# Altium schematic sheet Nrf2460_1.SchDoc: nRF2789_Dual_Wireless_Mic_RX
size A4; DrawnBy: ANOL; Revision: 1.0
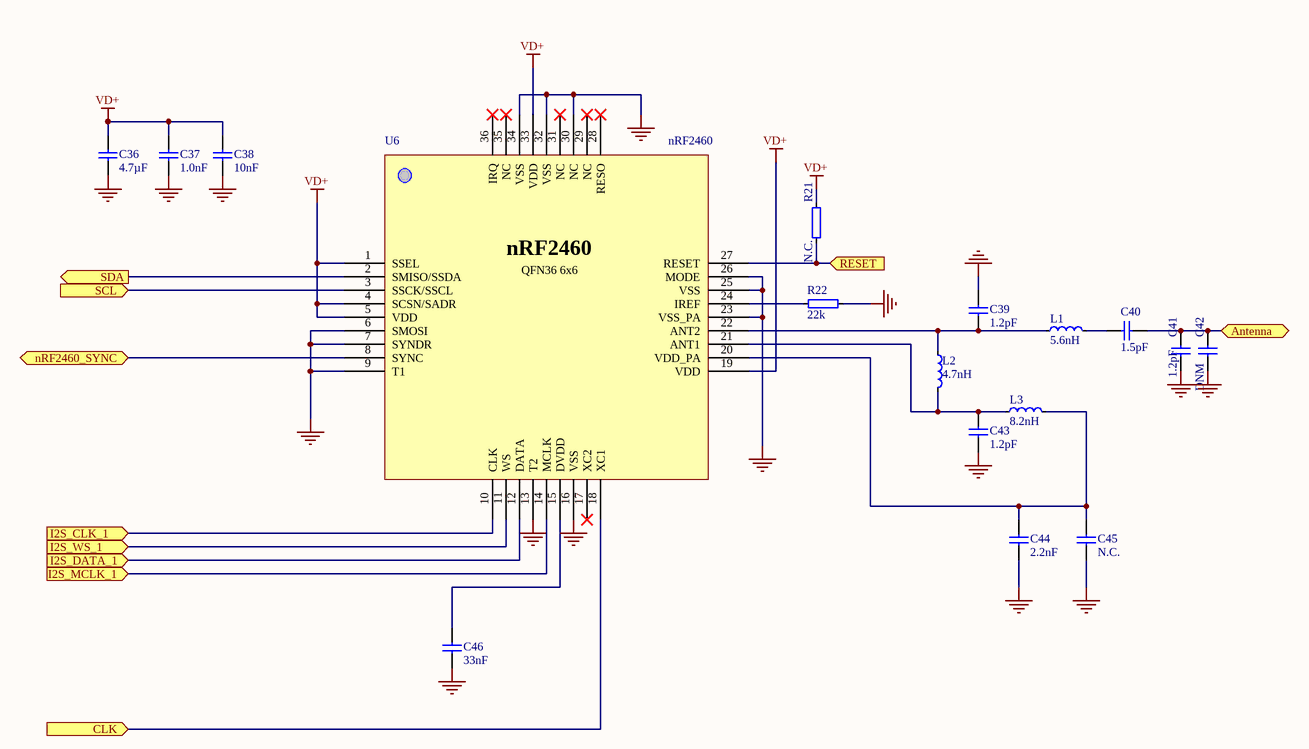
[diagram p0: Nrf2460_1.SchDoc]

## Parts
C36  4.7µF  [0805]
C37  1.0nF  [0402s]
C38  10nF  [0402s]
C39  1.2pF  [0402s]
C40  1.5pF  [0402s]
C41  1.2pF  [0402s]
C42  DNM  [0402s]
C43  1.2pF  [0402s]
C44  2.2nF  [0402s]
C45  N.C.  [0402s]  (no BOM)
C46  33nF  [0402s]
L1  5.6nH  [0402s]
L2  4.7nH  [0402s]
L3  8.2nH  [0402s]
R21  N.C.  [0402s]  (no BOM)
R22  22k  [0402s]
U6  nRF2460  [Nordic_QFN36]

## Ports
Antenna (bidir), CLK (in), I2S_CLK_1 (in), I2S_DATA_1 (in), I2S_MCLK_1 (in), I2S_WS_1 (in), nRF2460_SYNC (bidir), RESET (in), SCL (in), SDA (out)

## Nets
GND: C36.2 C37.2 C38.2 C39.2 C41.1 C42.1 C43.1 C44.1 C45.1 C46.1 R22.1 U6.6(SMOSI) U6.7(SYNDR) U6.9(T1) U6.13(T2) U6.16(VSS) U6.23(VSS_PA) U6.25(VSS) U6.26(MODE) U6.30(NC) U6.32(VSS) U6.34(VSS)
VD+: C36.1 C37.1 C38.1 R21.2 U6.1(SSEL) U6.4(SCSN/SADR) U6.5(VDD) U6.19(VDD) U6.33(VDD)
Antenna: C40.1 C41.2 C42.2 ; port Antenna
CLK: U6.18(XC1) ; port CLK
I2S_CLK_1: U6.10(CLK) ; port I2S_CLK_1
I2S_DATA_1: U6.12(DATA) ; port I2S_DATA_1
I2S_MCLK_1: U6.14(MCLK) ; port I2S_MCLK_1
I2S_WS_1: U6.11(WS) ; port I2S_WS_1
nRF2460_SYNC: U6.8(SYNC) ; port nRF2460_SYNC
RESET: R21.1 U6.27(RESET) ; port RESET
SCL: U6.3(SSCK/SSCL) ; port SCL
SDA: U6.2(SMISO/SSDA) ; port SDA
NetC39_1: C39.1 L1.1 L2.1 U6.22(ANT2)
NetC40_2: C40.2 L1.2
NetC43_2: C43.2 L2.2 L3.1 U6.21(ANT1)
NetC44_2: C44.2 C45.2 L3.2 U6.20(VDD_PA)
NetC46_2: C46.2 U6.15(DVDD)
NetR22_2: R22.2 U6.24(IREF)

Not connected (* = marked no-connect by the designer): U6 17(XC2)* 28(RESO)* 29(NC)* 31(NC)* 35(NC)* 36(IRQ)*

## Notes on the sheet
- (in symbol nRF2460) QFN36 6x6

## Library data of the parts
C36 = C0805-4µ7: Chip Cap 0805; Note: Chip Cap 10%; Artikkelnr Noca: 20039266; Published: 2009-08-21; LatestRevisionDate: 2009-11-23; Publisher: Nordic Semiconductor; Value: 4.7µF; Part Number: C0805-4µ7; Manufacturer: *; Manufacturer Part Number: *; Datasheet: *; Pin Count: 2; Supplier: *; Supplier part number: *; 2nd source Supplier: *; 2nd source part number: *
C37 = C0402-1n0: Chip Cap 0402; Note: Chip Cap 10%; Artikkelnr Noca: 20039223; Published: 2009-05-08; LatestRevisionDate: 2009-11-23; Publisher: Nordic Semiconductor; Value: 1.0nF; Part Number: C0402-1n0; Manufacturer: *; Manufacturer Part Number: *; Datasheet: *; Pin Count: 2; Supplier: *; Supplier part number: *; 2nd source Supplier: *; 2nd source part number: *
C38 = C0402-10n: Chip Cap 0402; Note: Chip Cap 10%; Artikkelnr Noca: 20039166; Published: 2009-05-08; LatestRevisionDate: 2009-11-23; Publisher: Nordic Semiconductor; Value: 10nF; Part Number: C0402-10n; Manufacturer: *; Manufacturer Part Number: *; Datasheet: *; Pin Count: 2; Supplier: *; Supplier part number: *; 2nd source Supplier: *; 2nd source part number: *
C39 C41-C43 = C0402-1.2p: Chip Cap 0402; Note: Chip Cap 1%; Artikkelnr Noca: N.A.; Part Number: C0402-1.2p; Manufacturer: *; Manufacturer Part Number: *; Datasheet: *; LatestRevisionDate: 2009-05-08; Pin Count: 2; Publisher: Nordic Semiconductor; Published: 2009-05-08; Supplier: *; Supplier part number: *; 2nd source Supplier: *; 2nd source part number: *
  C39 C41 C43: Value: 1.2pF
  C42: Value: DNM
C40 = C0402-1.5p: Chip Cap 0402; Note: Chip Cap 1%; Artikkelnr Noca: 20029139; Part Number: C0402-1.5p; Manufacturer: *; Manufacturer Part Number: *; Datasheet: *; LatestRevisionDate: 2009-11-23; Pin Count: 2; Publisher: Nordic Semiconductor; Published: 2009-05-08; Value: 1.5pF; Supplier: *; Supplier part number: *; 2nd source Supplier: *; 2nd source part number: *
C44 = C0402-2n2: Chip Cap 0402; Note: Chip Cap 10%; Artikkelnr Noca: 20039221; Part Number: C0402-2n2; Manufacturer: *; Manufacturer Part Number: *; Datasheet: *; LatestRevisionDate: 2009-11-23; Pin Count: 2; Publisher: Nordic Semiconductor; Published: 2009-05-08; Value: 2.2nF; Supplier: *; Supplier part number: *; 2nd source Supplier: *; 2nd source part number: *
C45 = C0402-N.C.: Chip Cap 0402; Artikkelnr Noca: N.A.; Part Number: C0402-N.C.; Manufacturer: *; Manufacturer Part Number: *; Datasheet: *; LatestRevisionDate: 2009-05-08; Pin Count: 2; Publisher: Nordic Semiconductor; Published: 2009-05-08; Value: N.C.; Note: Chip Cap; Supplier: *; Supplier part number: *; 2nd source Supplier: *; 2nd source part number: *
C46 = C0402-33n: Chip Cap 0402; Note: Chip Cap 10%; Artikkelnr Noca: 20039222; Published: 2009-05-08; Publisher: Nordic Semiconductor; Value: 33nF; Part Number: C0402-33n; Manufacturer: *; Manufacturer Part Number: *; Datasheet: *; LatestRevisionDate: 2009-11-23; Pin Count: 2; Supplier: *; Supplier part number: *; 2nd source Supplier: *; 2nd source part number: *
L1 = L0402-5n6: Chip Ind 0402; Manufacturer: Murata; Manufacturer Part Number: LQP15MN5N6B02D; Note: LQP15MN5N6B02D 5.6nH 140mA 0402; Artikkelnr Noca: 33029161; Part Number: L0402-5n6; Datasheet: http://search.murata.co.jp/Ceramy/image/img/PDF/ENG/L0075S0084LQP15M.pdf; Footprint: 0402; LatestRevisionDate: 2009-11-23; Pin Count: 2; Publisher: Nordic Semiconductor; Published: 2009-05-08; Value: 5.6nH; Supplier: Digi-Key; Supplier part number: 490-1133-1-ND; 2nd source Supplier: *; 2nd source part number: *
L2 = L0402-4n7: Chip Ind 0402; Manufacturer: Murata; Manufacturer Part Number: LQP15MN4N7B02D; Note: LQP15MN4N7B02D 4.7nH 160mA 0402; Artikkelnr Noca: 33029164; Part Number: L0402-4n7; Datasheet: http://search.murata.co.jp/Ceramy/image/img/PDF/ENG/L0075S0084LQP15M.pdf; Footprint: 0402; LatestRevisionDate: 2009-11-23; Pin Count: 2; Publisher: Nordic Semiconductor; Published: 2009-05-08; Value: 4.7nH; Supplier: Digi-Key; Supplier part number: 490-1132-1-ND; 2nd source Supplier: *; 2nd source part number: *
L3 = L0402-8n2: Chip Ind 0402; Manufacturer: Murata; Manufacturer Part Number: LQP15MN8N2B02D; Note: LQP15MN8N2B02D 8.2nH 110mA 0402; Artikkelnr Noca: 33029139; Part Number: L0402-8n2; Datasheet: http://search.murata.co.jp/Ceramy/image/img/PDF/ENG/L0075S0084LQP15M.pdf; Footprint: 0402; LatestRevisionDate: 2009-11-23; Pin Count: 2; Publisher: Nordic Semiconductor; Published: 2009-05-08; Value: 8.2nH; Supplier: Digi-Key; Supplier part number: 490-1135-1-ND; 2nd source Supplier: *; 2nd source part number: *
R21 = R0402-N.C.: Chip Res 0402; Part Number: R0402-N.C.; Manufacturer: *; Manufacturer Part Number: *; Datasheet: *; Footprint: 0402; LatestRevisionDate: 2009-05-08; Pin Count: 2; Publisher: Nordic Semiconductor; Published: 2009-05-08; Value: N.C.; Note: Chip Res; Supplier: *; Supplier part number: *; 2nd source Supplier: *; 2nd source part number: *; Artikkelnr Noca: *
R22 = R0402-22k: Chip Res 0402; Note: Chip Res 1%; Artikkelnr Noca: 27049105; Published: 2009-05-08; Publisher: Nordic Semiconductor; Value: 22k; Part Number: R0402-22k; Manufacturer: *; Manufacturer Part Number: *; Datasheet: *; Footprint: 0402; LatestRevisionDate: 2009-11-23; Pin Count: 2; Supplier: *; Supplier part number: *; 2nd source Supplier: *; 2nd source part number: *
U6 = nRF2460: 2.4GHz Single Chip Wireless Audio Streamer; Manufacturer: Nordic Semiconductor; Note: nRF2460 QFN36; Artikkelnr Noca: N.A.; Part Number: nRF2460; Manufacturer Part Number: nRF2460; Datasheet: *; Footprint: QFN-36; LatestRevisionDate: 2011-03-01; Pin Count: 36; Publisher: Nordic Semiconductor; Published: 2011-03-01; Value: nRF2460; Supplier: Nordic; Supplier part number: *; 2nd source Supplier: *; 2nd source part number: *